# Altium schematic sheet HLib-Comm-Ether.SchDoc
size A4
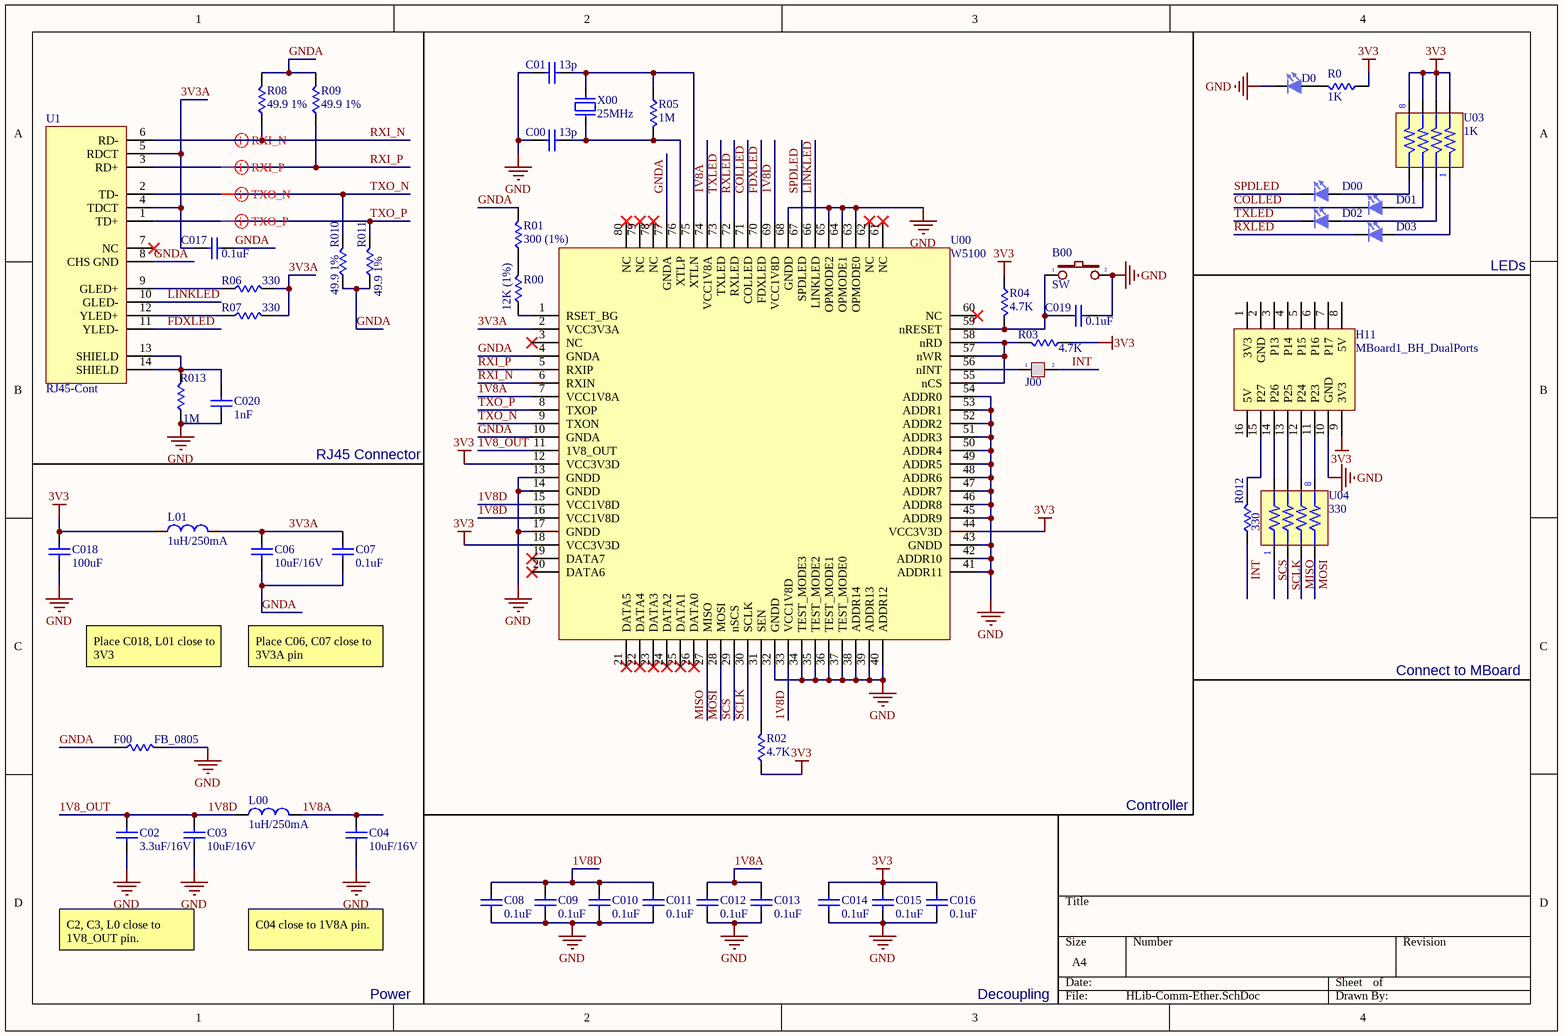
[diagram p0: HLib-Comm-Ether.SchDoc]

## Parts
B00  SW  [SW2SMD]
C00  value 13p  [SM_0805_C_CERAMIC]  (hidden comment: C_Ceramic)
C01  value 13p  [SM_0805_C_CERAMIC]  (hidden comment: C_Ceramic)
C02  value 3.3uF/16V  [SM_0805_C_CERAMIC]  (hidden comment: C_Ceramic)
C03  value 10uF/16V  [SM_0805_C_CERAMIC]  (hidden comment: C_Ceramic)
C04  value 10uF/16V  [SM_0805_C_CERAMIC]  (hidden comment: C_Ceramic)
C06  value 10uF/16V  [SM_0805_C_CERAMIC]  (hidden comment: C_Ceramic)
C07  value 0.1uF  [SM_0805_C_CERAMIC]  (hidden comment: C_Ceramic)
C08  value 0.1uF  [SM_0805_C_CERAMIC]  (hidden comment: C_Ceramic)
C09  value 0.1uF  [SM_0805_C_CERAMIC]  (hidden comment: C_Ceramic)
C010  value 0.1uF  [SM_0805_C_CERAMIC]  (hidden comment: C_Ceramic)
C011  value 0.1uF  [SM_0805_C_CERAMIC]  (hidden comment: C_Ceramic)
C012  value 0.1uF  [SM_0805_C_CERAMIC]  (hidden comment: C_Ceramic)
C013  value 0.1uF  [SM_0805_C_CERAMIC]  (hidden comment: C_Ceramic)
C014  value 0.1uF  [SM_0805_C_CERAMIC]  (hidden comment: C_Ceramic)
C015  value 0.1uF  [SM_0805_C_CERAMIC]  (hidden comment: C_Ceramic)
C016  value 0.1uF  [SM_0805_C_CERAMIC]  (hidden comment: C_Ceramic)
C017  value 0.1uF  [SM_0805_C_CERAMIC]  (hidden comment: C_Ceramic)
C018  value 100uF  [Cap-Alu-D8]  (hidden comment: C_Ceramic)
C019  value 0.1uF  [SM_0805_C_CERAMIC]  (hidden comment: C_Ceramic)
C020  value 1nF  [SM_0805_C_CERAMIC]  (hidden comment: C_Ceramic)
D00  LED  [SM_0805_LED]  (value not drawn)
D0  LED  [SM_0805_LED]  (value not drawn)
D01  LED  [SM_0805_LED]  (value not drawn)
D02  LED  [SM_0805_LED]  (value not drawn)
D03  LED  [SM_0805_LED]  (value not drawn)
F00  value FB_0805  [SM_0805_R]  (hidden comment: R)
H11  MBoard1_BH_DualPorts  [MBoard1_BH_DualPorts]
J00  Jumper 2  [Hed2]  (value not drawn)
L00  1uH/250mA  [SM_0805_R]
L01  1uH/250mA  [SM_0805_R]
R00  value 12K (1%)  [SM_0805_R]  (hidden comment: R)
R0  value 1K  [SM_0805_R]  (hidden comment: R)
R01  value 300 (1%)  [SM_0805_R]  (hidden comment: R)
R02  value 4.7K  [SM_0805_R]  (hidden comment: R)
R03  value 4.7K  [SM_0805_R]  (hidden comment: R)
R04  value 4.7K  [SM_0805_R]  (hidden comment: R)
R05  value 1M  [SM_0805_R]  (hidden comment: R)
R06  value 330  [SM_0805_R]  (hidden comment: R)
R07  value 330  [SM_0805_R]  (hidden comment: R)
R08  value 49.9 1%  [SM_0805_R]  (hidden comment: R)
R09  value 49.9 1%  [SM_0805_R]  (hidden comment: R)
R010  value 49.9 1%  [SM_0805_R]  (hidden comment: R)
R011  value 49.9 1%  [SM_0805_R]  (hidden comment: R)
R012  value 330  [SM_0805_R]  (hidden comment: R)
R013  value 1M  [SM_0805_R]  (hidden comment: R)
U00  W5100  [LQFP80]
U1  RJ45-Cont  [RJ45-Cont]
U03  1K  [RA4]
U04  330  [RA4]
X00  25MHz  [HC49/US-SMD]

## Nets
3V3: C014.2 C015.2 C016.2 C018.1 H11.9(3V3) L01.1 R0.1 R02.1 R03.1 R04.1 U00.12(VCC3V3D) U00.18(VCC3V3D) U00.44(VCC3V3D) U03.2 U03.4 U03.6 U03.8
GND: B00.2 C00.1 C01.1 C02.1 C03.1 C04.1 C08.1 C09.1 C010.1 C011.1 C012.1 C013.1 C014.1 C015.1 C016.1 C018.2 C019.1 C020.2 D0.2(K) F00.2 H11.10(GND) R013.1 U00.13(GNDD) U00.14(GNDD) U00.17(GNDD) U00.32(GNDD) U00.34(TEST_MODE3) U00.35(TEST_MODE2) U00.36(TEST_MODE1) U00.37(TEST_MODE0) U00.38(ADDR14) U00.39(ADDR13) U00.40(ADDR12) U00.41(ADDR11) U00.42(ADDR10) U00.43(GNDD) U00.45(ADDR9) U00.46(ADDR8) U00.47(ADDR7) U00.48(ADDR6) U00.49(ADDR5) U00.50(ADDR4) U00.51(ADDR3) U00.52(ADDR2) U00.53(ADDR1) U00.54(ADDR0) U00.63(OPMODE0) U00.64(OPMODE1) U00.65(OPMODE2) U00.68(GNDD)
1V8_OUT: C02.2 C03.2 C08.2 C09.2 C010.2 C011.2 L00.1 U00.11(1V8_OUT) U00.15(VCC1V8D) U00.16(VCC1V8D) U00.33(VCC1V8D) U00.69(VCC1V8D)  [also labelled 1V8D]
1V8A: C04.2 C012.2 C013.2 L00.2 U00.7(VCC1V8A) U00.74(VCC1V8A)
3V3A: C06.2 C07.2 C017.2 L01.2 R06.2 R07.2 U00.2(VCC3V3A) U1.4(TDCT) U1.5(RDCT)
COLLED: D01.2(K) U00.71(COLLED)
FDXLED: U00.70(FDXLED) U1.11(YLED-)
GNDA: C06.1 C07.1 C017.1 F00.1 R01.2 R08.2 R09.2 R010.1 R011.1 U00.4(GNDA) U00.10(GNDA) U00.77(GNDA) U1.8(CHS_GND)
INT: J00.2 R012.1
LINKLED: U00.66(LINKLED) U1.10(GLED-)
MISO: U00.27(MISO) U04.5
MOSI: U00.28(MOSI) U04.7
RXI_N: R08.1 U00.6(RXIN) U1.6(RD-)
RXI_P: R09.1 U00.5(RXIP) U1.3(RD+)
RXLED: D03.2(K) U00.72(RXLED)
SCLK: U00.30(SCLK) U04.3
SCS: U00.29(nSCS) U04.1
SPDLED: D00.2(K) U00.67(SPDLED)
TXLED: D02.2(K) U00.73(TXLED)
TXO_N: R010.2 U00.9(TXON) U1.2(TD-)
TXO_P: R011.2 U00.8(TXOP) U1.1(TD+)
NetB00_1: B00.1 C019.2 R04.2 U00.59(nRESET)
NetC00_2: C00.2 R05.2 U00.76(XTLP) X00.2
NetC01_2: C01.2 R05.1 U00.75(XTLN) X00.1
NetC020_1: C020.1 R013.2 U1.13(SHIELD) U1.14(SHIELD)
NetD00_1: D00.1(A) U03.7
NetD0_1: D0.1(A) R0.2
NetD01_1: D01.1(A) U03.5
NetD02_1: D02.1(A) U03.3
NetD03_1: D03.1(A) U03.1
NetH11_11: H11.11(P23) U04.8
NetH11_12: H11.12(P24) U04.6
NetH11_13: H11.13(P25) U04.4
NetH11_14: H11.14(P26) U04.2
NetH11_15: H11.15(P27) R012.2
NetJ00_1: J00.1 U00.56(nINT)
NetR00_1: R00.1 U00.1(RSET_BG)
NetR00_2: R00.2 R01.1
NetR02_2: R02.2 U00.31(SEN)
NetR03_2: R03.2 U00.55(nCS) U00.57(nWR) U00.58(nRD)
NetR06_1: R06.1 U1.9(GLED+)
NetR07_1: R07.1 U1.12(YLED+)

Not connected (* = marked no-connect by the designer): H11 1(3V3) 2(GND) 3(P13) 4(P14) 5(P15) 6(P16) 7(P17) 8(5V) 16(5V); U00 3(NC)* 19(DATA7)* 20(DATA6)* 21(DATA5)* 22(DATA4)* 23(DATA3)* 24(DATA2)* 25(DATA1)* 26(DATA0)* 60(NC)* 61(NC)* 62(NC)* 78(NC)* 79(NC)* 80(NC)*; U1 7(NC)*

## Layout directives
differential pair: RXI_N, RXI_P, TXO_N, TXO_P

## Notes on the sheet
- LEDs
- RJ45 Connector
- Place C018, L01 close to 3V3
- Place C06, C07 close to 3V3A pin
- Connect to MBoard
- Controller
- C2, C3, L0 close to 1V8_OUT pin.
- C04 close to 1V8A pin.
- Power
- Decoupling

## Library data of the parts
B00 = SW2: Switch button 2 pin; Value: SW chip 2 pin
C00 C01 C02 C03 C04 C06 C07 C08 C09 C010 C011 C012 C013 C014 C015 C016 C017 C018 C019 C020 = C_Ceramic: Non-polarity ceramic capacitor; Published: 8-Jun-2000; LatestRevisionDate: 17-Jul-2002; LatestRevisionNote: Re-released for DXP Platform.; PackageReference: RAD-0.3; Publisher: Altium Limited; PackageDescription: Radial Cap, Thru-Hole; 2 Leads; 0.3 in Pin Spacing
F00 R00 R0 R01 R02 R03 R04 R05 R06 R07 R08 R09 R010 R011 R012 R013 = R: Resistor; Published: 8-Jun-2000; LatestRevisionDate: 29-May-2009; LatestRevisionNote: IPC-7351 Footprint Added.; PackageReference: J1-0603; Publisher: Altium Limited; PackageDescription: Chip Resistor
J00 = JP 2: Value: JP 2
L00 L01 = L1: Inductor; Value: 150 mH
U03 U04 = RA4
X00 = XT2: Crystal For all Crystal 2pin.; Value: 4Mhz
D00 D0 D01 D02 D03 = LED: Published: 8-Jun-2000; LatestRevisionDate: 08-Jul-2005; LatestRevisionNote: Mech Layer 1 removed.; PackageReference: LED-1; Publisher: Altium Limited; PackageDescription: LED; 2 Leads